# EAGLE schematic MISC (EAGLE 9.5.1)
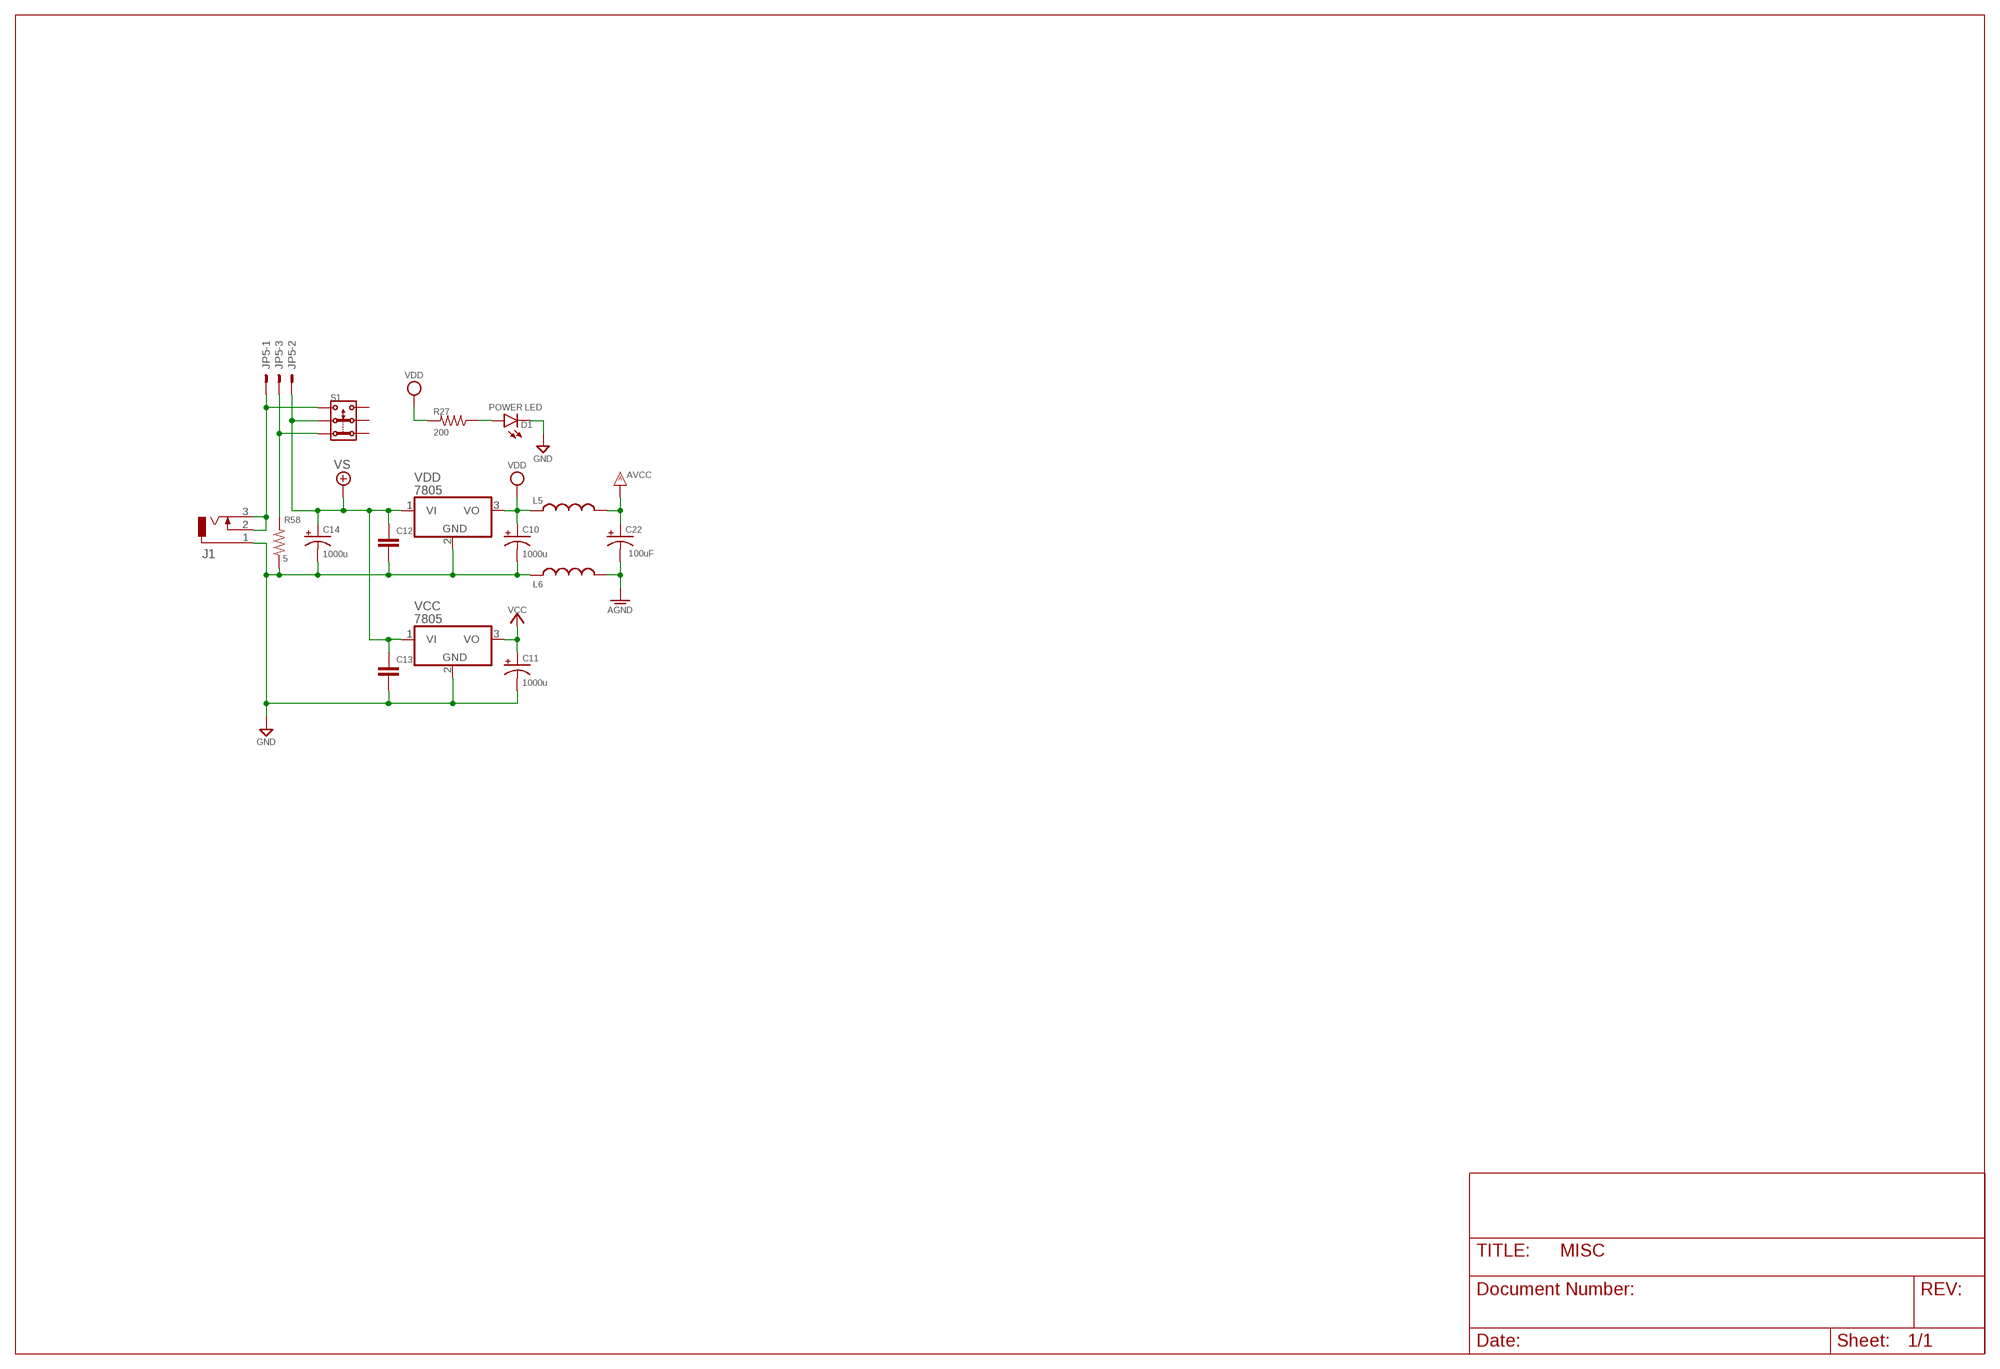
[diagram p0: schematic, sheet 1]

## Parts
C10  1000u  CPOL-USE3.5-10  [E3,5-10]
C11  1000u  CPOL-USE3.5-10  [E3,5-10]
C12  C-EUC0805  [C0805]
C13  C-EUC0805  [C0805]
C14  1000u  CPOL-USE3.5-10  [E3,5-10]
C22  100uF  CPOL-USTAP5-50  [TAP5-50]
D1  POWER LED  TLLG4400  [LED3MM]
J1  DCJ0202  [DCJ0202]
JP5  22-23-2031  [22-23-2031]
L5  L-US0204/7  [0204/7]
L6  L-US0204/7  [0204/7]
R27  200  R-US_0204/7  [0204/7]
R58  5  R-US_0204/7  [0204/7]
S1  2P2T  [2P2T]
VCC  7805  7805TV  [TO220V]
VDD  7805  7805TV  [TO220V]

## Nets
+9V: C12.1 C13.1 C14.+ JP5.2 S1.2.1 VCC.1(VI) VDD.1(VI) ; supply symbol labelled VS
AGND: C22.- L6.2
AVCC: C22.+ L5.2
GND: C10.- C11.- C12.2 C13.2 C14.- D1.K(C) J1.1 L6.1 R58.1 VCC.2(GND) VDD.2(GND)
N$1: J1.2 J1.3 JP5.1 S1.3.1
N$2: JP5.3 R58.2 S1.1.1
N$3: D1.A R27.1
VCC: C11.+ VCC.3(VO)
VDD: C10.+ L5.1 R27.2 VDD.3(VO)
Unconnected: S1.1.2 S1.2.2 S1.3.2

## Library data of the parts
C10 C11 C14 C22 = rcl:CPOL-US: POLARIZED CAPACITOR, American symbol; SPICEPREFIX: C
C12 C13 = rcl:C-EU: CAPACITOR, European symbol; SPICEPREFIX: C
D1 = led:TLLG4400: Low Current (2mA) LED 3 mm Tinted Diffused Package color GREEN Source: Data sheet <http://www.farnell.com/datasheets/391098.pdf>; MF: VISHAY SEMICONDUCTOR; OC_FARNELL: 1612435
J1 = con-jack:DCJ0202: DC POWER JACK Source: DCJ0202.pdf; OC_FARNELL: unknown; OC_NEWARK: unknown
JP5 = con-molex:22-23-2031: .100" (2.54mm) Center Header - 3 Pin; MF: MOLEX; MPN: 22-23-2031; OC_FARNELL: 1462950; OC_NEWARK: 30C0862
L5 L6 = rcl:L-US: INDUCTOR, American symbol; SPICEPREFIX: L
R27 R58 = rcl:R-US_: RESISTOR, American symbol; SPICEPREFIX: R
S1 = switch:2P2T: SLIDE SWITCH 2P2T Part No. SS-22F05-G(A)4 Source: CANAL ELECTRONIC CO., LTD .. switsch.pdf
VCC VDD = linear:78*: Positive VOLTAGE REGULATOR Source: http://cache.national.com/ds/LM/LM78L05.pdf http://www.fairchildsemi.com/ds/LM/LM7805.pdf